# Altium schematic sheet DE-220124.SchDoc: RS485 8 port hub
size A3; Author: eldar6776@hotmail.com; DrawnBy: Eldar Dedic; Organization: JUBERA d.o.o.; Address1: Braće Mulić 81; Address2: 71000 Sarajevo; Address3: Federacija BiH; Address4: Bosna i Hercegovina; DocumentNumber: DE-220124; Revision: 001; SheetNumber: 1; SheetTotal: 2
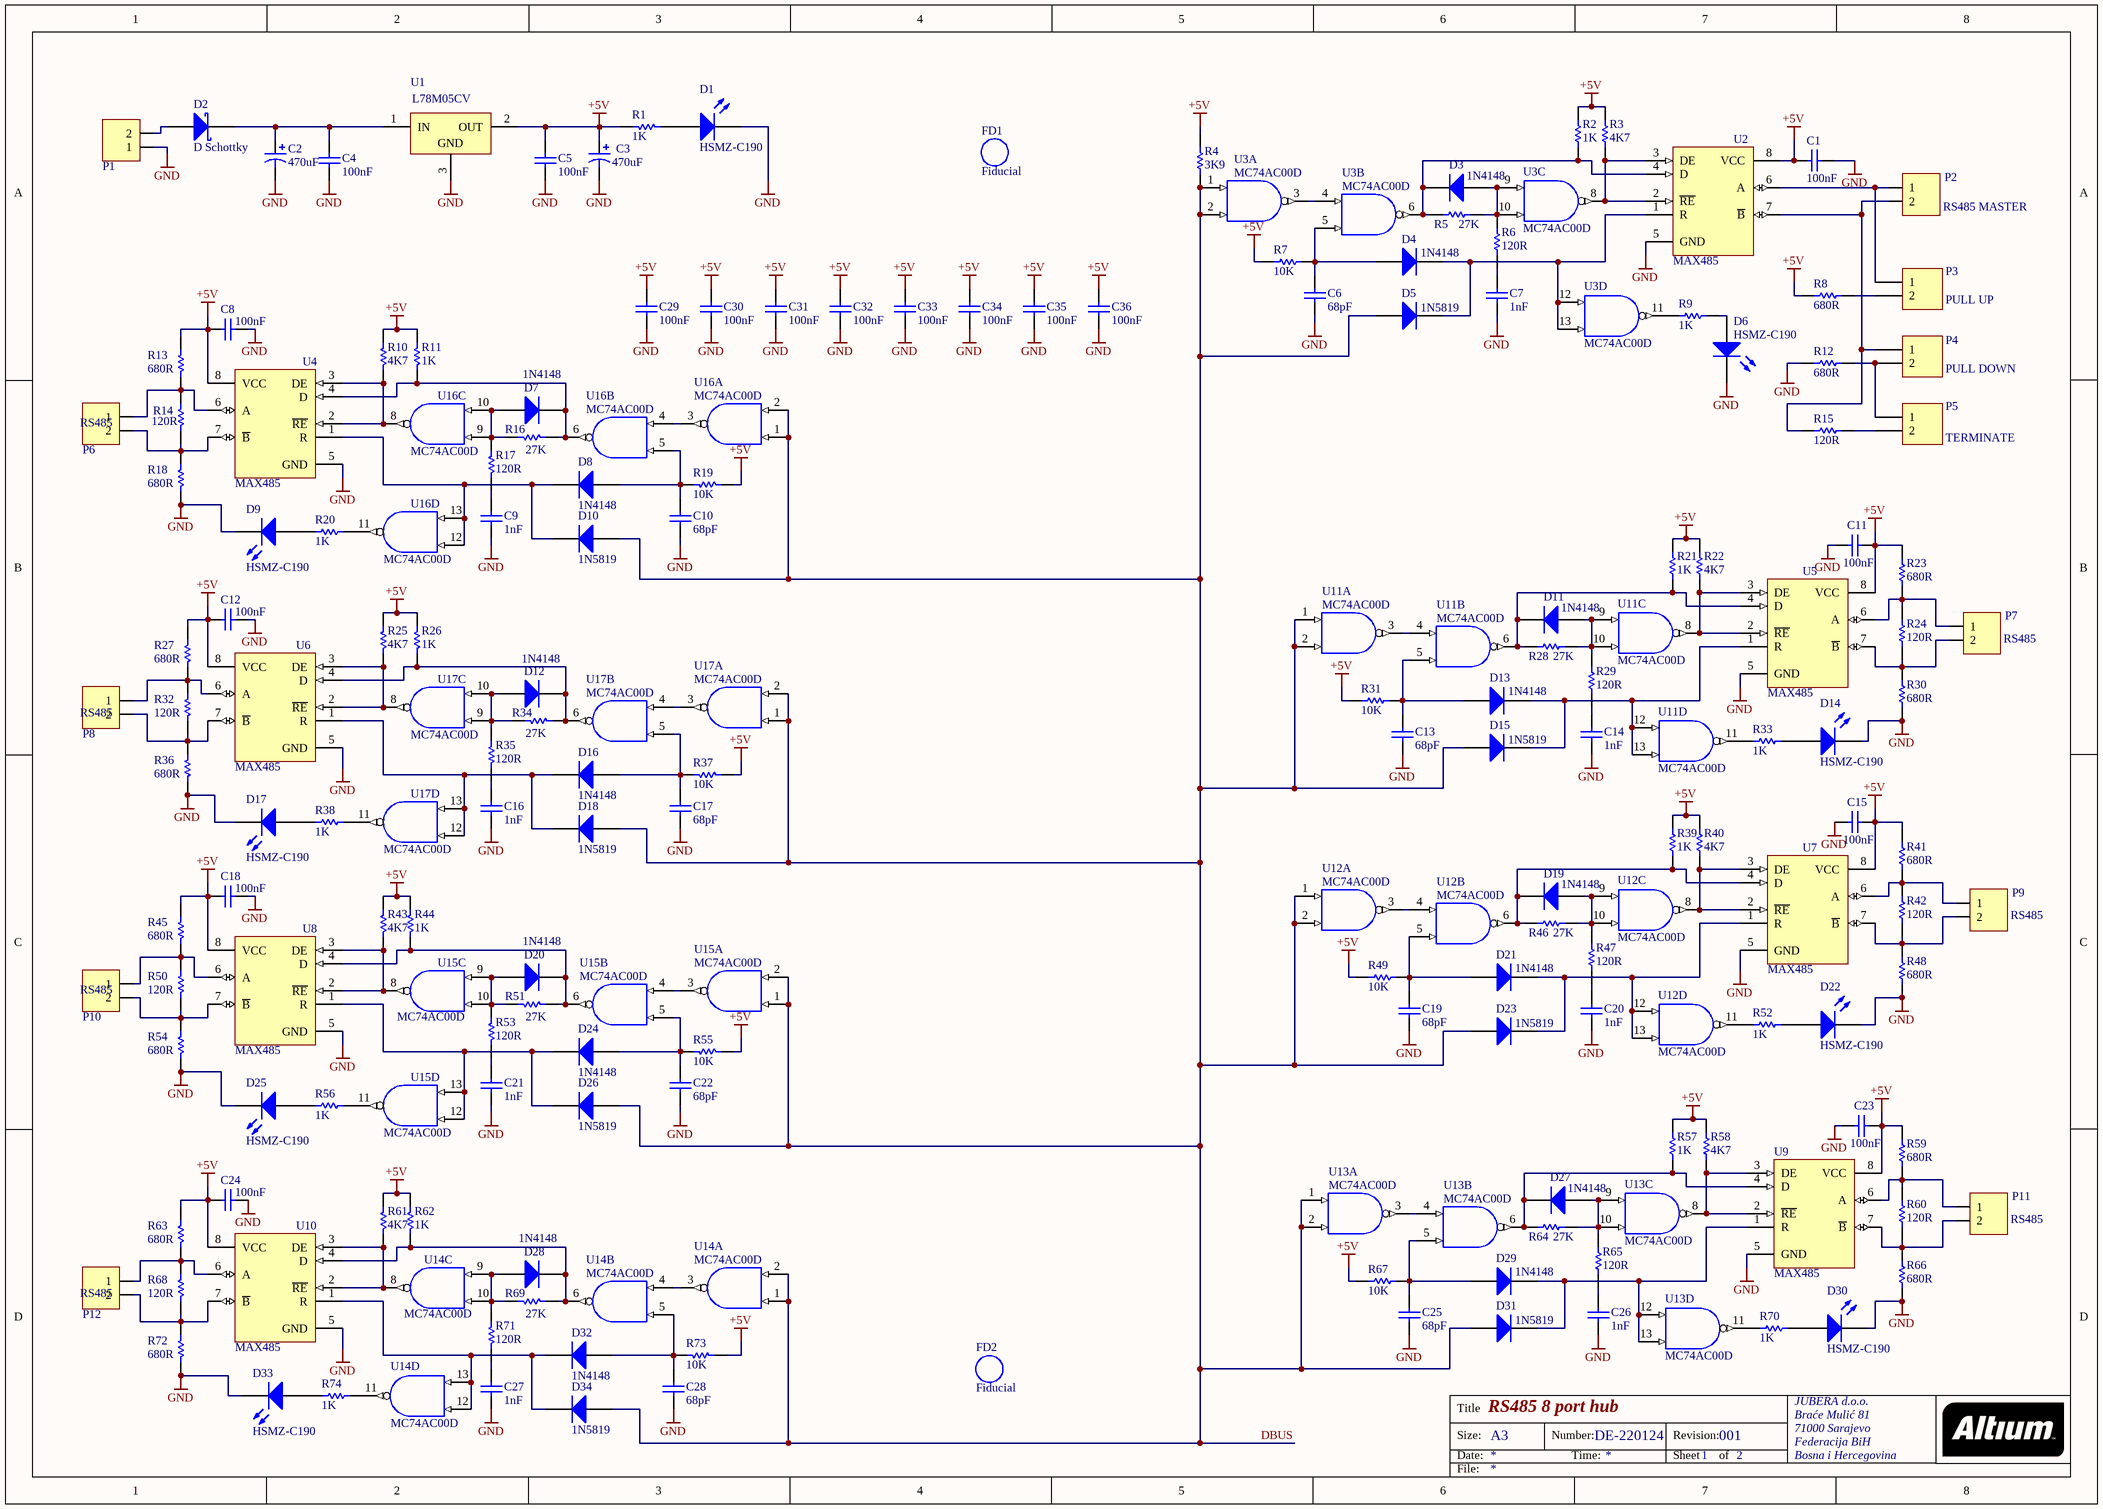
[diagram p0: DE-220124.SchDoc]

## Parts
C1  100nF  [0603]
C2  470uF  [CAPPR5-10X12.5]
C3  470uF  [CAPPR5-10X12.5]
C4  100nF  [0603]
C5  100nF  [0603]
C6  68pF  [0603]
C7  1nF  [0603]
C8  100nF  [0603]
C9  1nF  [0603]
C10  68pF  [0603]
C11  100nF  [0603]
C12  100nF  [0603]
C13  68pF  [0603]
C14  1nF  [0603]
C15  100nF  [0603]
C16  1nF  [0603]
C17  68pF  [0603]
C18  100nF  [0603]
C19  68pF  [0603]
C20  1nF  [0603]
C21  1nF  [0603]
C22  68pF  [0603]
C23  100nF  [0603]
C24  100nF  [0603]
C25  68pF  [0603]
C26  1nF  [0603]
C27  1nF  [0603]
C28  68pF  [0603]
C29  100nF  [0603]
C30  100nF  [0603]
C31  100nF  [0603]
C32  100nF  [0603]
C33  100nF  [0603]
C34  100nF  [0603]
C35  100nF  [0603]
C36  100nF  [0603]
D1  HSMZ-C190  [1.6X0.8X0.8]
D2  D Schottky  [SMB]
D3  1N4148  [SOD323]
D4  1N4148  [SOD323]
D5  1N5819  [SOD323]
D6  HSMZ-C190  [1.6X0.8X0.8]
D7  1N4148  [SOD323]
D8  1N4148  [SOD323]
D9  HSMZ-C190  [1.6X0.8X0.8]
D10  1N5819  [SOD323]
D11  1N4148  [SOD323]
D12  1N4148  [SOD323]
D13  1N4148  [SOD323]
D14  HSMZ-C190  [1.6X0.8X0.8]
D15  1N5819  [SOD323]
D16  1N4148  [SOD323]
D17  HSMZ-C190  [1.6X0.8X0.8]
D18  1N5819  [SOD323]
D19  1N4148  [SOD323]
D20  1N4148  [SOD323]
D21  1N4148  [SOD323]
D22  HSMZ-C190  [1.6X0.8X0.8]
D23  1N5819  [SOD323]
D24  1N4148  [SOD323]
D25  HSMZ-C190  [1.6X0.8X0.8]
D26  1N5819  [SOD323]
D27  1N4148  [SOD323]
D28  1N4148  [SOD323]
D29  1N4148  [SOD323]
D30  HSMZ-C190  [1.6X0.8X0.8]
D31  1N5819  [SOD323]
D32  1N4148  [SOD323]
D33  HSMZ-C190  [1.6X0.8X0.8]
D34  1N5819  [SOD323]
FD1  Fiducial  [Fiducial]  (no BOM)
FD2  Fiducial  [Fiducial]  (no BOM)
P1  TERMINAL BLOK 2  [TERMINAL BLOK 2]  (value not drawn)
P2  TERMINAL BLOK 2  [TERMINAL BLOK 2]  (value not drawn)
P3  PULL UP  [HDR1X2]
P4  PULL DOWN  [HDR1X2]
P5  TERMINATE  [HDR1X2]
P6  TERMINAL BLOK 2  [TERMINAL BLOK 2]  (value not drawn)
P7  TERMINAL BLOK 2  [TERMINAL BLOK 2]  (value not drawn)
P8  TERMINAL BLOK 2  [TERMINAL BLOK 2]  (value not drawn)
P9  TERMINAL BLOK 2  [TERMINAL BLOK 2]  (value not drawn)
P10  TERMINAL BLOK 2  [TERMINAL BLOK 2]  (value not drawn)
P11  TERMINAL BLOK 2  [TERMINAL BLOK 2]  (value not drawn)
P12  TERMINAL BLOK 2  [TERMINAL BLOK 2]  (value not drawn)
R1  1K  [ERA-0805]
R2  1K  [ERA-0805]
R3  4K7  [ERA-0805]
R4  3K9  [ERA-0805]
R5  27K  [ERA-0805]
R6  120R  [ERA-0805]
R7  10K  [ERA-0805]
R8  680R  [ERA-0805]
R9  1K  [ERA-0805]
R10  4K7  [ERA-0805]
R11  1K  [ERA-0805]
R12  680R  [ERA-0805]
R13  680R  [ERA-0805]
R14  120R  [ERA-0805]
R15  120R  [ERA-0805]
R16  27K  [ERA-0805]
R17  120R  [ERA-0805]
R18  680R  [ERA-0805]
R19  10K  [ERA-0805]
R20  1K  [ERA-0805]
R21  1K  [ERA-0805]
R22  4K7  [ERA-0805]
R23  680R  [ERA-0805]
R24  120R  [ERA-0805]
R25  4K7  [ERA-0805]
R26  1K  [ERA-0805]
R27  680R  [ERA-0805]
R28  27K  [ERA-0805]
R29  120R  [ERA-0805]
R30  680R  [ERA-0805]
R31  10K  [ERA-0805]
R32  120R  [ERA-0805]
R33  1K  [ERA-0805]
R34  27K  [ERA-0805]
R35  120R  [ERA-0805]
R36  680R  [ERA-0805]
R37  10K  [ERA-0805]
R38  1K  [ERA-0805]
R39  1K  [ERA-0805]
R40  4K7  [ERA-0805]
R41  680R  [ERA-0805]
R42  120R  [ERA-0805]
R43  4K7  [ERA-0805]
R44  1K  [ERA-0805]
R45  680R  [ERA-0805]
R46  27K  [ERA-0805]
R47  120R  [ERA-0805]
R48  680R  [ERA-0805]
R49  10K  [ERA-0805]
R50  120R  [ERA-0805]
R51  27K  [ERA-0805]
R52  1K  [ERA-0805]
R53  120R  [ERA-0805]
R54  680R  [ERA-0805]
R55  10K  [ERA-0805]
R56  1K  [ERA-0805]
R57  1K  [ERA-0805]
R58  4K7  [ERA-0805]
R59  680R  [ERA-0805]
R60  120R  [ERA-0805]
R61  4K7  [ERA-0805]
R62  1K  [ERA-0805]
R63  680R  [ERA-0805]
R64  27K  [ERA-0805]
R65  120R  [ERA-0805]
R66  680R  [ERA-0805]
R67  10K  [ERA-0805]
R68  120R  [ERA-0805]
R69  27K  [ERA-0805]
R70  1K  [ERA-0805]
R71  120R  [ERA-0805]
R72  680R  [ERA-0805]
R73  10K  [ERA-0805]
R74  1K  [ERA-0805]
U1  L78M05CV  [TO220V]
U2  MAX485  [D008_L]
U3  MC74AC00D  [751A-03_N]  (parts A,B,C,D of 4)
U4  MAX485  [D008_L]
U5  MAX485  [D008_L]
U6  MAX485  [D008_L]
U7  MAX485  [D008_L]
U8  MAX485  [D008_L]
U9  MAX485  [D008_L]
U10  MAX485  [D008_L]
U11  MC74AC00D  [751A-03_N]  (parts A,B,C,D of 4)
U12  MC74AC00D  [751A-03_N]  (parts A,B,C,D of 4)
U13  MC74AC00D  [751A-03_N]  (parts A,B,C,D of 4)
U14  MC74AC00D  [751A-03_N]  (parts A,B,C,D of 4)
U15  MC74AC00D  [751A-03_N]  (parts A,B,C,D of 4)
U16  MC74AC00D  [751A-03_N]  (parts A,B,C,D of 4)
U17  MC74AC00D  [751A-03_N]  (parts A,B,C,D of 4)

## Nets
+5V: C1.1 C3.1 C5.2 C8.2 C11.2 C12.2 C15.2 C18.2 C23.2 C24.2 C29.2 C30.2 C31.2 C32.2 C33.2 C34.2 C35.2 C36.2 R1.2 R2.2 R3.2 R4.2 R7.1 R8.2 R10.2 R11.2 R13.1 R19.1 R21.2 R22.2 R23.1 R25.2 R26.2 R27.1 R31.1 R37.1 R39.2 R40.2 R41.1 R43.2 R44.2 R45.1 R49.1 R55.1 R57.2 R58.2 R59.1 R61.2 R62.2 R63.1 R67.1 R73.1 U1.2(OUT) U2.8(VCC) U4.8(VCC) U5.8(VCC) U6.8(VCC) U7.8(VCC) U8.8(VCC) U9.8(VCC) U10.8(VCC)
GND: C1.2 C2.2 C3.2 C4.1 C5.1 C6.1 C7.1 C8.1 C9.1 C10.1 C11.1 C12.1 C13.1 C14.1 C15.1 C16.1 C17.1 C18.1 C19.1 C20.1 C21.1 C22.1 C23.1 C24.1 C25.1 C26.1 C27.1 C28.1 C29.1 C30.1 C31.1 C32.1 C33.1 C34.1 C35.1 C36.1 D1.2(K) D6.2(K) D9.2(K) D14.2(K) D17.2(K) D22.2(K) D25.2(K) D30.2(K) D33.2(K) P1.1 R12.2 R18.2 R30.2 R36.2 R48.2 R54.2 R66.2 R72.2 U1.3(GND) U2.5(GND) U3.7(GND) U4.5(GND) U5.5(GND) U6.5(GND) U7.5(GND) U8.5(GND) U9.5(GND) U10.5(GND) U11.7(GND) U12.7(GND) U13.7(GND) U14.7(GND) U15.7(GND) U16.7(GND) U17.7(GND)
VCC: U3.14(+5V) U11.14(+5V) U12.14(+5V) U13.14(+5V) U14.14(+5V) U15.14(+5V) U16.14(+5V) U17.14(+5V)
DBUS: D5.2(A) D10.2(A) D15.2(A) D18.2(A) D23.2(A) D26.2(A) D31.2(A) D34.2(A) R4.1 U3.1(A) U3.2(B) U11.1(A) U11.2(B) U12.1(A) U12.2(B) U13.1(A) U13.2(B) U14.1(A) U14.2(B) U15.1(A) U15.2(B) U16.1(A) U16.2(B) U17.1(A) U17.2(B)
NetC2_1: C2.1 C4.2 D2.2(K) U1.1(IN)
NetC6_2: C6.2 D4.2(A) R7.2 U3.5(B)
NetC7_2: C7.2 R6.1
NetC9_2: C9.2 R17.1
NetC10_2: C10.2 D8.2(A) R19.2 U16.5(B)
NetC13_2: C13.2 D13.2(A) R31.2 U11.5(B)
NetC14_2: C14.2 R29.1
NetC16_2: C16.2 R35.1
NetC17_2: C17.2 D16.2(A) R37.2 U17.5(B)
NetC19_2: C19.2 D21.2(A) R49.2 U12.5(B)
NetC20_2: C20.2 R47.1
NetC21_2: C21.2 R53.1
NetC22_2: C22.2 D24.2(A) R55.2 U15.5(B)
NetC25_2: C25.2 D29.2(A) R67.2 U13.5(B)
NetC26_2: C26.2 R65.1
NetC27_2: C27.2 R71.1
NetC28_2: C28.2 D32.2(A) R73.2 U14.5(B)
NetD1_1: D1.1(A) R1.1
NetD2_1: D2.1(A) P1.2
NetD3_1: D3.1(K) R2.1 R5.2 U2.4(D) U3.6(~{Y})
NetD3_2: D3.2(A) R5.1 R6.2 U3.9(A) U3.10(B)
NetD4_1: D4.1(K) D5.1(K) U2.1(R) U3.12(A) U3.13(B)
NetD6_1: D6.1(A) R9.2
NetD7_1: D7.1(K) R11.1 R16.2 U4.4(D) U16.6(~{Y})
NetD7_2: D7.2(A) R16.1 R17.2 U16.9(A) U16.10(B)
NetD8_1: D8.1(K) D10.1(K) U4.1(R) U16.12(A) U16.13(B)
NetD9_1: D9.1(A) R20.1
NetD11_1: D11.1(K) R21.1 R28.2 U5.4(D) U11.6(~{Y})
NetD11_2: D11.2(A) R28.1 R29.2 U11.9(A) U11.10(B)
NetD12_1: D12.1(K) R26.1 R34.2 U6.4(D) U17.6(~{Y})
NetD12_2: D12.2(A) R34.1 R35.2 U17.9(A) U17.10(B)
NetD13_1: D13.1(K) D15.1(K) U5.1(R) U11.12(A) U11.13(B)
NetD14_1: D14.1(A) R33.2
NetD16_1: D16.1(K) D18.1(K) U6.1(R) U17.12(A) U17.13(B)
NetD17_1: D17.1(A) R38.1
NetD19_1: D19.1(K) R39.1 R46.2 U7.4(D) U12.6(~{Y})
NetD19_2: D19.2(A) R46.1 R47.2 U12.9(A) U12.10(B)
NetD20_1: D20.1(K) R44.1 R51.2 U8.4(D) U15.6(~{Y})
NetD20_2: D20.2(A) R51.1 R53.2 U15.9(A) U15.10(B)
NetD21_1: D21.1(K) D23.1(K) U7.1(R) U12.12(A) U12.13(B)
NetD22_1: D22.1(A) R52.2
NetD24_1: D24.1(K) D26.1(K) U8.1(R) U15.12(A) U15.13(B)
NetD25_1: D25.1(A) R56.1
NetD27_1: D27.1(K) R57.1 R64.2 U9.4(D) U13.6(~{Y})
NetD27_2: D27.2(A) R64.1 R65.2 U13.9(A) U13.10(B)
NetD28_1: D28.1(K) R62.1 R69.2 U10.4(D) U14.6(~{Y})
NetD28_2: D28.2(A) R69.1 R71.2 U14.9(A) U14.10(B)
NetD29_1: D29.1(K) D31.1(K) U9.1(R) U13.12(A) U13.13(B)
NetD30_1: D30.1(A) R70.2
NetD32_1: D32.1(K) D34.1(K) U10.1(R) U14.12(A) U14.13(B)
NetD33_1: D33.1(A) R74.1
NetP2_1: P2.1 P3.1 U2.6(A)
NetP2_2: P2.2 P4.1 R15.2 U2.7(~{B})
NetP3_2: P3.2 R8.1
NetP4_2: P4.2 P5.1 R12.1
NetP5_2: P5.2 R15.1
NetP6_1: P6.1 R13.2 R14.1 U4.6(A)
NetP6_2: P6.2 R14.2 R18.1 U4.7(~{B})
NetP7_1: P7.1 R23.2 R24.1 U5.6(A)
NetP7_2: P7.2 R24.2 R30.1 U5.7(~{B})
NetP8_1: P8.1 R27.2 R32.1 U6.6(A)
NetP8_2: P8.2 R32.2 R36.1 U6.7(~{B})
NetP9_1: P9.1 R41.2 R42.1 U7.6(A)
NetP9_2: P9.2 R42.2 R48.1 U7.7(~{B})
NetP10_1: P10.1 R45.2 R50.1 U8.6(A)
NetP10_2: P10.2 R50.2 R54.1 U8.7(~{B})
NetP11_1: P11.1 R59.2 R60.1 U9.6(A)
NetP11_2: P11.2 R60.2 R66.1 U9.7(~{B})
NetP12_1: P12.1 R63.2 R68.1 U10.6(A)
NetP12_2: P12.2 R68.2 R72.1 U10.7(~{B})
NetR3_1: R3.1 U2.2(~{RE}) U2.3(DE) U3.8(~{Y})
NetR9_1: R9.1 U3.11(~{Y})
NetR10_1: R10.1 U4.2(~{RE}) U4.3(DE) U16.8(~{Y})
NetR20_2: R20.2 U16.11(~{Y})
NetR22_1: R22.1 U5.2(~{RE}) U5.3(DE) U11.8(~{Y})
NetR25_1: R25.1 U6.2(~{RE}) U6.3(DE) U17.8(~{Y})
NetR33_1: R33.1 U11.11(~{Y})
NetR38_2: R38.2 U17.11(~{Y})
NetR40_1: R40.1 U7.2(~{RE}) U7.3(DE) U12.8(~{Y})
NetR43_1: R43.1 U8.2(~{RE}) U8.3(DE) U15.8(~{Y})
NetR52_1: R52.1 U12.11(~{Y})
NetR56_2: R56.2 U15.11(~{Y})
NetR58_1: R58.1 U9.2(~{RE}) U9.3(DE) U13.8(~{Y})
NetR61_1: R61.1 U10.2(~{RE}) U10.3(DE) U14.8(~{Y})
NetR70_1: R70.1 U13.11(~{Y})
NetR74_2: R74.2 U14.11(~{Y})
NetU3_3: U3.3(~{Y}) U3.4(A)
NetU11_3: U11.3(~{Y}) U11.4(A)
NetU12_3: U12.3(~{Y}) U12.4(A)
NetU13_3: U13.3(~{Y}) U13.4(A)
NetU14_3: U14.3(~{Y}) U14.4(A)
NetU15_3: U15.3(~{Y}) U15.4(A)
NetU16_3: U16.3(~{Y}) U16.4(A)
NetU17_3: U17.3(~{Y}) U17.4(A)

## Notes on the sheet
- (near P2) RS485 MASTER
- (near P6) RS485
- (near P7) RS485
- (near P8) RS485
- (near P9) RS485
- (near P10) RS485
- (near P11) RS485
- (near P12) RS485
- Title
- Size:
- Date:
- A3
- Number:
- Time:
- Revision:
- Sheet
- of
- File:

## Library data of the parts
C1 C4-C36 = C0603: Ceramic Chip Capacitor - Standard; Note: Footprint corresponds to dimensions for bulk cassette packaging. This case size has tightened tolerances.; Published: 17-Jul-2002; LatestRevisionDate: 19-Mar-2004; LatestRevisionNote: Silkscreen size reduced.; DatasheetDocument: Mar-2001; PackageDocument: Mar-2001; PackageReference: 0603; Publisher: Altium Limited; Code_JEITA: 0603; Code_IPC: 1608 [0603]; ComponentLink1Description: Manufacturer Link; ComponentLink1URL: http://www.kemet.com/; ComponentLink2Description: Datasheet; ComponentLink2URL: http://www.kemet.com/kemet/web/homepage/kechome.nsf/vapubfilesname/F3102TA.pdf/$file/F3102TA.pdf
C2 C3 = EKA00DC347E00: Aluminum Electrolytic Capacitor, Radial Style with Long Leads: 470uF, 25V; Note: Refer to Manufacturer's Data Sheets for other lead formations; DrillSize: Nominal, Rounded To The Nearest 0.1mm; Published: 19-Mar-2004; DatasheetDocument: 20-Feb-2001; PackageReference: CAPPR5-10X12.5; Publisher: Altium Limited; ComponentLink1Description: Manufacturer Link; ComponentLink1URL: http://www.vishay.com/; ComponentLink2Description: Datasheet; ComponentLink2URL: http://www.vishay.com/docs/25014/eka.pdf; Value: 470uF
D1 D6 D9 D14 D17 D22 D25 D30 D33 = HSMZ-C190: High Performance Chip LED, Red; LuminousIntensity: 40mcd (Minimum).; PCB_Layout: Complies with manufacturer's recommendation.; Published: 11-Dec-2002; DatasheetVersion: 11-Mar-2002; PackageVersion: Mar-2002; PackageReference: 1.6X0.8X0.8; Publisher: Altium Limited; PackageDescription: SM LED; 2 Flat Leads; LED_Colour: Red; ComponentLink1Description: Manufacturer Link; ComponentLink1URL: http://www.avagotech.com/; ComponentLink2Description: Datasheet; ComponentLink2URL: http://cp.literature.agilent.com/litweb/pdf/5988-5891EN.pdf
D2 = D Schottky: Schottky Diode; Published: 8-Jun-2000; LatestRevisionDate: 17-Jul-2002; LatestRevisionNote: Re-released for DXP Platform.; PackageReference: SMB; Publisher: Altium Limited; PackageDescription: DO-214-AA/SMB; 2 C-Bend Leads; Body 5.3 x 3.6 mm, inc. leads (LxW); Code_JEDEC: DO-214-AA
D3-D5 D7 D8 D10-D13 D15 D16 D18-D21 D23 D24 D26-D29 D31 D32 D34 = BAS321: General-purpose Diode; Published: 17-Sep-2003; LatestRevisionDate: 19-Mar-2004; LatestRevisionNote: Silkscreen size reduced.; DatasheetVersion: 9-Feb-1999; PackageVersion: May-1999; PackageReference: SOD323; Publisher: Altium Limited; PackageDescription: SOD-323/SC-76; 2 Leads; Body 1.7 x 1.3 mm, (LxW); ComponentLink1Description: Manufacturer Link; ComponentLink1URL: http://www.semiconductors.philips.com/; ComponentLink2Description: Datasheet; ComponentLink2URL: http://www.semiconductors.philips.com/acrobat/datasheets/BAS321_2.pdf
FD1 FD2 = Fiduchial: Fiduchial mark
P1 P2 P6-P12 = TERMINAL BLOK 2: 2 pinski terminal blok
P3-P5 = Header 2: Header, 2-Pin; LatestRevisionDate: 17-Jul-2002; LatestRevisionNote: Re-released for DXP Platform.; Publisher: Altium Limited
R1-R74 = ERA6Y: Rectangular Thick Film Chip Resistor, 10 Ohm to 1M Ohm Range, 0.1% and 0.5% Tolerance, 0805 Size, 0.1 W; Note: If flow soldering, adjust pad width of PCB Footprint to 0.7 - 0.8 times the width of the resistor.; Published: 17-Dec-2003; LatestRevisionDate: 19-Mar-2004; LatestRevisionNote: Silkscreen size reduced.; PackageDocument: Mar-2003; PackageReference: ERA-0805; Publisher: Altium Limited; Code_IPC: 2012 [0805]; ComponentLink1Description: Manufacturer Link; ComponentLink1URL: http://www.panasonic.com/industrial/components/resistive_products.htm; ComponentLink2Description: Datasheet; ComponentLink2URL: http://www.panasonic.com/industrial/components/pdf/AOA0000CE8.pdf
U1 = L78M05CV: Positive Voltage Regulator; Note: Tab is connected to pin 3 (GND).; Published: 24-Aug-2001; LatestRevisionDate: 17-Jul-2002; LatestRevisionNote: Re-released for DXP Platform.; DatasheetVersion: Apr-1994; PackageReference: TO220V; Publisher: Altium Limited; PackageDescription: TO, Thru-Hole, Vertical, Heatsink Mounted; 3 In-Line Leads; Pitch 2.54 mm; Pin sequence 1, 3, 2; ComponentLink1Description: Manufacturer Link; ComponentLink1URL: http://www.st.com/; ComponentLink2Description: Datasheet; ComponentLink2URL: http://www.st.com/stonline/products/literature/ds/2146/l78m05c.pdf
U2 U4-U10 = SN75176BD: Differential Bus Transceiver; Note: Receiver Hysteresis of 50mV Typical; Published: 15-May-2002; LatestRevisionDate: 13-Apr-2006; LatestRevisionNote: IPC-7351 Footprint Added.; DatasheetVersion: Sep-1989; PackageVersion: Jan-1998; PackageReference: D008; Publisher: Altium Limited; PackageDescription: 8-Pin Small Outline Integrated Circuit 1.27 mm Pitch; Code_IPC: SOIC127P600-8; ComponentLink1Description: Manufacturer Link; ComponentLink1URL: http://www.ti.com/; ComponentLink2Description: Datasheet; ComponentLink2URL: http://www-s.ti.com/sc/ds/sn75176b.pdf
U3 U11-U17 = MC74AC00D: Quad 2-Input NAND Gate; Published: 15-Apr-2002; LatestRevisionDate: 13-Apr-2006; LatestRevisionNote: IPC-7351 Footprint Added.; DatasheetVersion: 9-Apr-1996; PackageReference: 751A-03; Publisher: Altium Limited; PackageDescription: 14-Pin Small Outline Integrated Circuit 1.27 mm Pitch; Code_JEDEC: MS-012-AB; Code_IPC: SOIC127P600-14; ComponentLink1Description: Manufacturer Link; ComponentLink1URL: http://www.onsemi.com/; ComponentLink2Description: Datasheet; ComponentLink2URL: http://www.onsemi.com/pub/Collateral/MC74AC00-D.PDF